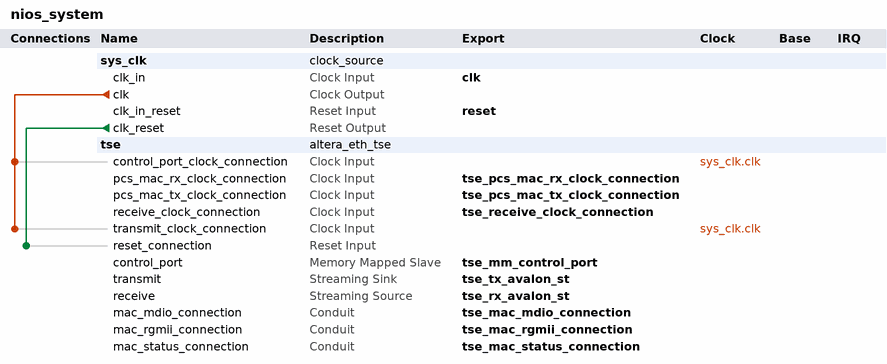
[diagram p0: system contents]
# Platform Designer (Qsys) system nios_system, Cyclone IV E EP4CE115F29C7
# Parameters at their usual value, and those the tool derives, are not listed.
package require -exact qsys 16.1
create_system nios_system
set_project_property DEVICE_FAMILY {Cyclone IV E}
set_project_property DEVICE EP4CE115F29C7

add_instance sys_clk clock_source 16.1
set_instance_parameter_value sys_clk clockFrequency 100000000

add_instance tse altera_eth_tse 16.1
set_instance_parameter_value tse core_variation MAC_ONLY
set_instance_parameter_value tse eg_addr 14
set_instance_parameter_value tse enable_hd_logic true
set_instance_parameter_value tse enable_mac_flow_ctrl true
set_instance_parameter_value tse enable_magic_detect true
set_instance_parameter_value tse enable_shift16 true
set_instance_parameter_value tse ifGMII RGMII
set_instance_parameter_value tse ing_addr 11
set_instance_parameter_value tse mdio_clk_div 40
set_instance_parameter_value tse stat_cnt_ena true
set_instance_parameter_value tse transceiver_type NONE

# connections
add_connection sys_clk.clk tse.control_port_clock_connection clock
add_connection sys_clk.clk tse.transmit_clock_connection clock
add_connection sys_clk.clk_reset tse.reset_connection reset

# exported interfaces
add_interface clk clock sink
set_interface_property clk EXPORT_OF sys_clk.clk_in
add_interface reset reset sink
set_interface_property reset EXPORT_OF sys_clk.clk_in_reset
add_interface tse_mac_mdio_connection conduit end
set_interface_property tse_mac_mdio_connection EXPORT_OF tse.mac_mdio_connection
add_interface tse_mac_rgmii_connection conduit end
set_interface_property tse_mac_rgmii_connection EXPORT_OF tse.mac_rgmii_connection
add_interface tse_mac_status_connection conduit end
set_interface_property tse_mac_status_connection EXPORT_OF tse.mac_status_connection
add_interface tse_mm_control_port avalon slave
set_interface_property tse_mm_control_port EXPORT_OF tse.control_port
add_interface tse_pcs_mac_rx_clock_connection clock sink
set_interface_property tse_pcs_mac_rx_clock_connection EXPORT_OF tse.pcs_mac_rx_clock_connection
add_interface tse_pcs_mac_tx_clock_connection clock sink
set_interface_property tse_pcs_mac_tx_clock_connection EXPORT_OF tse.pcs_mac_tx_clock_connection
add_interface tse_receive_clock_connection clock sink
set_interface_property tse_receive_clock_connection EXPORT_OF tse.receive_clock_connection
add_interface tse_rx_avalon_st avalon_streaming source
set_interface_property tse_rx_avalon_st EXPORT_OF tse.receive
add_interface tse_tx_avalon_st avalon_streaming sink
set_interface_property tse_tx_avalon_st EXPORT_OF tse.transmit

set_interconnect_requirement {$system} qsys_mm.clockCrossingAdapter HANDSHAKE
set_interconnect_requirement {$system} qsys_mm.enableEccProtection FALSE
set_interconnect_requirement {$system} qsys_mm.insertDefaultSlave FALSE
set_interconnect_requirement {$system} qsys_mm.maxAdditionalLatency 1

save_system nios_system.qsys
